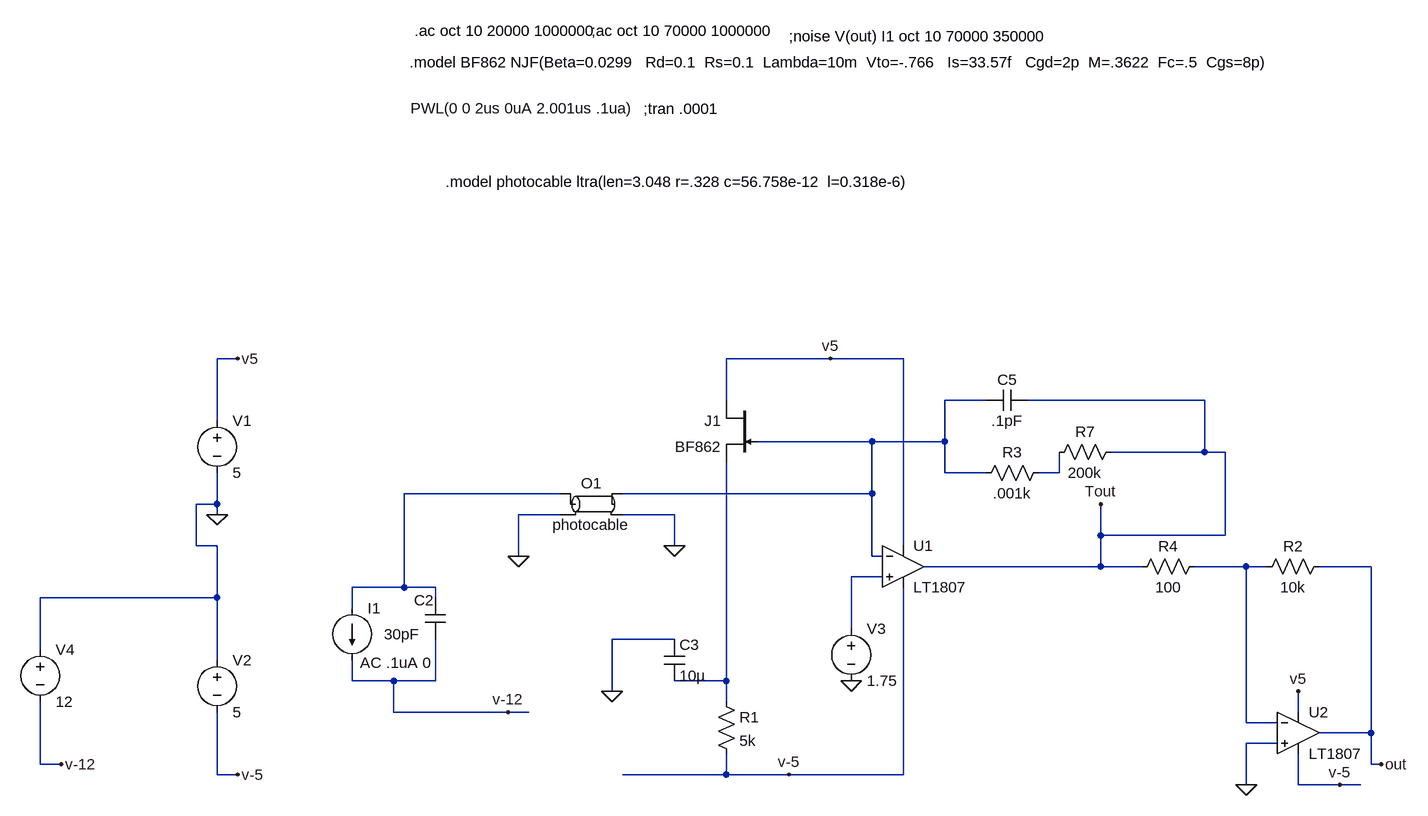
[diagram p0: schematic LT1807 wsign wave&cable&bootstrap_4_28_10_1ac analysis.asc]
LT1807 wsign wave&cable&bootstrap_4_28_10_1ac analysis.asc, the LTspice schematic file:
Version 4
SHEET 1 3232 872
WIRE -256 -256 -288 -256
WIRE 656 -256 496 -256
WIRE 768 -256 656 -256
WIRE 496 -192 496 -256
WIRE 896 -192 832 -192
WIRE 1232 -192 960 -192
WIRE -288 -160 -288 -256
WIRE 720 -128 544 -128
WIRE 832 -128 832 -192
WIRE 832 -128 720 -128
WIRE 1232 -112 1232 -192
WIRE 1232 -112 1088 -112
WIRE 1264 -112 1232 -112
WIRE 832 -80 832 -128
WIRE 896 -80 832 -80
WIRE 1008 -80 1008 -112
WIRE 1008 -80 976 -80
WIRE 240 -48 0 -48
WIRE 720 -48 720 -128
WIRE 720 -48 336 -48
WIRE -288 -32 -288 -80
WIRE -288 -32 -320 -32
WIRE -288 -16 -288 -32
WIRE 240 -16 176 -16
WIRE 416 -16 336 -16
WIRE 1072 16 1072 -32
WIRE 1264 16 1264 -112
WIRE 1264 16 1072 16
WIRE -320 32 -320 -32
WIRE -288 32 -320 32
WIRE 416 32 416 -16
WIRE 768 32 768 -256
WIRE 176 48 176 -16
WIRE 720 48 720 -48
WIRE 736 48 720 48
WIRE 1072 64 1072 16
WIRE 1072 64 800 64
WIRE 1136 64 1072 64
WIRE 1296 64 1216 64
WIRE 1328 64 1296 64
WIRE 1488 64 1408 64
WIRE 736 80 688 80
WIRE 0 96 0 -48
WIRE 0 96 -80 96
WIRE 48 96 0 96
WIRE -288 112 -288 32
WIRE -288 112 -560 112
WIRE 48 112 48 96
WIRE -80 128 -80 96
WIRE 688 160 688 80
WIRE 416 176 320 176
WIRE -560 192 -560 112
WIRE -288 208 -288 112
WIRE -80 240 -80 208
WIRE -16 240 -80 240
WIRE 48 240 48 176
WIRE 48 240 -16 240
WIRE 496 240 496 -96
WIRE 496 240 416 240
WIRE 320 256 320 176
WIRE 496 272 496 240
WIRE -16 288 -16 240
WIRE 160 288 -16 288
WIRE 192 288 160 288
WIRE 1376 288 1376 256
WIRE 1296 304 1296 64
WIRE 1344 304 1296 304
WIRE 1488 320 1488 64
WIRE 1488 320 1408 320
WIRE 1344 336 1296 336
WIRE -560 368 -560 272
WIRE -528 368 -560 368
WIRE 1488 368 1488 320
WIRE 1504 368 1488 368
WIRE -288 384 -288 288
WIRE -256 384 -288 384
WIRE 496 384 496 352
WIRE 496 384 336 384
WIRE 592 384 496 384
WIRE 768 384 768 96
WIRE 768 384 592 384
WIRE 1296 400 1296 336
WIRE 1376 400 1376 352
WIRE 1440 400 1376 400
WIRE 1472 400 1440 400
FLAG -288 -16 0
FLAG 688 240 0
FLAG 1376 256 v5
FLAG 1504 368 out
FLAG 1296 400 0
FLAG 1440 400 v-5
FLAG -256 -256 v5
FLAG -256 384 v-5
FLAG 656 -256 v5
FLAG 592 384 v-5
FLAG 176 48 0
FLAG 416 32 0
FLAG 1072 -32 Tout
FLAG -528 368 v-12
FLAG 160 288 v-12
FLAG 320 256 0
SYMBOL voltage -288 -176 R0
SYMATTR InstName V1
SYMATTR Value 5
SYMBOL current -80 128 R0
WINDOW 3 90 -769 Left 0
WINDOW 123 12 84 Left 0
WINDOW 39 0 0 Left 0
SYMATTR Value PWL(0 0 2us 0uA 2.001us .1ua)
SYMATTR Value2 AC .1uA 0
SYMATTR InstName I1
SYMBOL voltage -288 192 R0
SYMATTR InstName V2
SYMATTR Value 5
SYMBOL cap 32 112 R0
WINDOW 0 -17 4 Left 0
WINDOW 3 -63 56 Left 0
SYMATTR InstName C2
SYMATTR Value 30pF
SYMBOL res 992 -96 R90
WINDOW 0 0 56 VBottom 0
WINDOW 3 32 56 VTop 0
SYMATTR InstName R3
SYMATTR Value .001k
SYMBOL cap 960 -208 R90
WINDOW 0 0 32 VBottom 0
WINDOW 3 32 32 VTop 0
SYMATTR InstName C5
SYMATTR Value .1pF
SYMBOL njf 544 -192 M0
SYMATTR InstName J1
SYMATTR Value BF862
SYMBOL res 480 256 R0
SYMATTR InstName R1
SYMATTR Value 5k
SYMBOL voltage 688 144 R0
WINDOW 123 0 0 Left 0
WINDOW 39 0 0 Left 0
SYMATTR InstName V3
SYMATTR Value 1.75
SYMBOL res 1424 48 R90
WINDOW 0 0 56 VBottom 0
WINDOW 3 32 56 VTop 0
SYMATTR InstName R2
SYMATTR Value 10k
SYMATTR SpiceLine tol=1
SYMBOL res 1232 48 R90
WINDOW 0 0 56 VBottom 0
WINDOW 3 32 56 VTop 0
SYMATTR InstName R4
SYMATTR Value 100
SYMATTR SpiceLine tol=1
SYMBOL cap 400 176 R0
SYMATTR InstName C3
SYMATTR Value 10µ
SYMBOL ltline 288 -32 R0
SYMATTR InstName O1
SYMATTR Value photocable
SYMBOL res 1104 -128 R90
WINDOW 0 0 56 VBottom 0
WINDOW 3 32 56 VTop 0
SYMATTR InstName R7
SYMATTR Value 200k
SYMBOL Opamps\\LT1807 768 0 R0
SYMATTR InstName U1
SYMBOL Opamps\\LT1807 1376 256 R0
SYMATTR InstName U2
SYMBOL voltage -560 176 R0
WINDOW 123 0 0 Left 0
WINDOW 39 0 0 Left 0
SYMATTR InstName V4
SYMATTR Value 12
TEXT 8 -712 Left 0 !.model BF862 NJF(Beta=0.0299   Rd=0.1  Rs=0.1  Lambda=10m  Vto=-.766   Is=33.57f   Cgd=2p  M=.3622  Fc=.5  Cgs=8p)
TEXT 16 -760 Left 0 !.ac oct 10 20000 1000000
TEXT 368 -640 Left 0 !;tran .0001
TEXT 288 -760 Left 0 !;ac oct 10 70000 1000000
TEXT 592 -752 Left 0 !;noise V(out) I1 oct 10 70000 350000
TEXT 64 -528 Left 0 !.model photocable ltra(len=3.048 r=.328 c=56.758e-12  l=0.318e-6)

The netlist it stands for:
* LT1807 wsign wave&cable&bootstrap_4_28_10_1ac analysis.asc
V1 v5 0 5
I1 N003 v-12 PWL(0 0 2us 0uA 2.001us .1ua) AC .1uA 0
V2 0 v-5 5
C2 N003 v-12 30pF
R3 N002 N001 .001k
C5 Tout N001 .1pF
J1 v5 N001 N006 BF862
R1 N006 v-5 5k
V3 N005 0 1.75
R2 out N004 10k tol=1
R4 N004 Tout 100 tol=1
C3 0 N006 10µ
O1 N003 0 N001 0 photocable
R7 Tout N002 200k
XU1 N005 N001 v5 v-5 Tout LT1807  ; pins In+ In- V+ V- OUT
XU2 0 N004 v5 v-5 out LT1807  ; pins In+ In- V+ V- OUT
V4 0 v-12 12
.model NJF NJF
.model PJF PJF
.lib standard.jft
.model BF862 NJF(Beta=0.0299   Rd=0.1  Rs=0.1  Lambda=10m  Vto=-.766   Is=33.57f   Cgd=2p  M=.3622  Fc=.5  Cgs=8p)
.ac oct 10 20000 1000000
;tran .0001
;ac oct 10 70000 1000000
;noise V(out) I1 oct 10 70000 350000
.model photocable ltra(len=3.048 r=.328 c=56.758e-12  l=0.318e-6)
.backanno
.end